# Altium schematic sheet MOSFETS.SchDoc
size A4; SheetNumber: 3; SheetTotal: 7
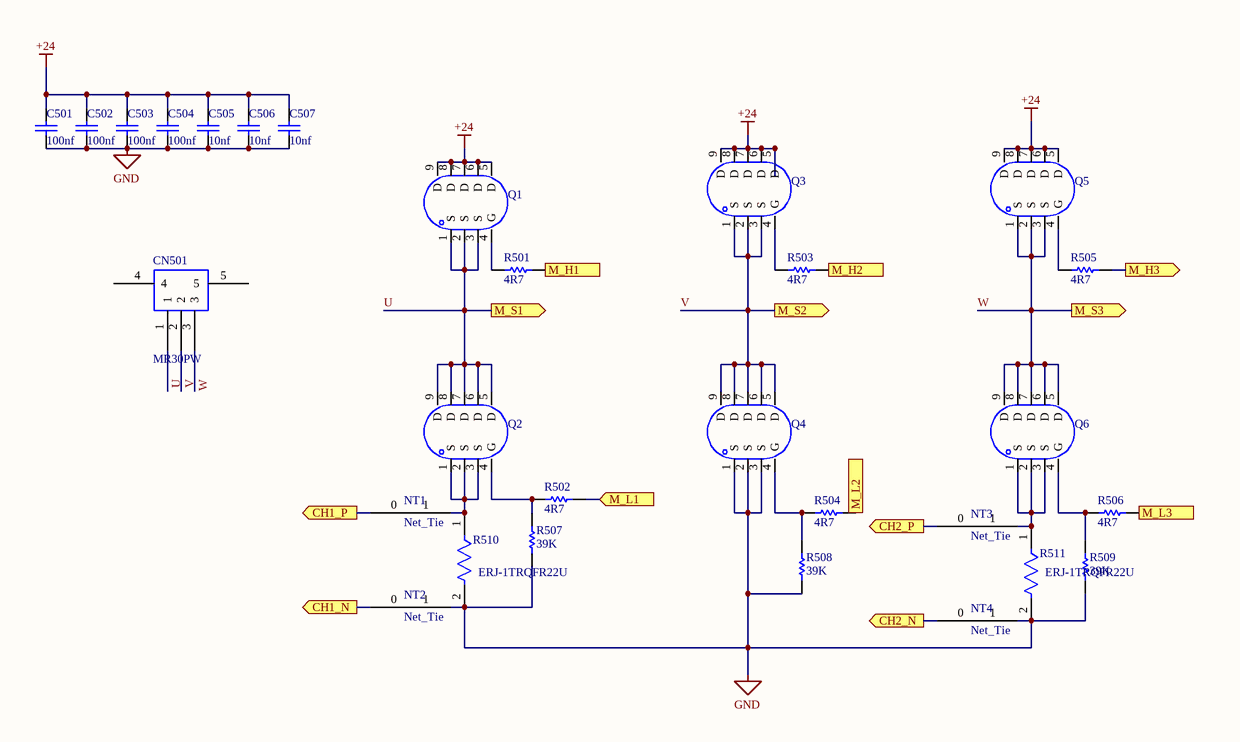
[diagram p0: MOSFETS.SchDoc]

## Parts
C501  100nf  [AVX-1206-2_L]
C502  100nf  [AVX-1206-2_L]
C503  100nf  [AVX-1206-2_L]
C504  100nf  [AVX-1206-2_L]
C505  10nf  [AVX-1206-2_L]
C506  10nf  [AVX-1206-2_L]
C507  10nf  [AVX-1206-2_L]
CN501  MR30PW  [MR30]
NT1  Net_Tie  [NT]  (net tie, no BOM)
NT2  Net_Tie  [NT]  (net tie, no BOM)
NT3  Net_Tie  [NT]  (net tie, no BOM)
NT4  Net_Tie  [NT]  (net tie, no BOM)
Q1  TPH1R403NL  [DSOP-8_L5.0-W5.0-P1.27-EP-TL]  (value not drawn)
Q2  TPH1R403NL  [DSOP-8_L5.0-W5.0-P1.27-EP-TL]  (value not drawn)
Q3  TPH1R403NL  [DSOP-8_L5.0-W5.0-P1.27-EP-TL]  (value not drawn)
Q4  TPH1R403NL  [DSOP-8_L5.0-W5.0-P1.27-EP-TL]  (value not drawn)
Q5  TPH1R403NL  [DSOP-8_L5.0-W5.0-P1.27-EP-TL]  (value not drawn)
Q6  TPH1R403NL  [DSOP-8_L5.0-W5.0-P1.27-EP-TL]  (value not drawn)
R501  4R7  [RESC1608X55X25ML10T15]
R502  4R7  [RESC1608X55X25ML10T15]
R503  4R7  [RESC1608X55X25ML10T15]
R504  4R7  [RESC1608X55X25ML10T15]
R505  4R7  [RESC1608X55X25ML10T15]
R506  4R7  [RESC1608X55X25ML10T15]
R507  39K  [RESC1608X55X25ML10T15]
R508  39K  [RESC1608X55X25ML10T15]
R509  39K  [RESC1608X55X25ML10T15]
R510  ERJ-1TRQFR22U  [FP-ERJ1TR-MFG]
R511  ERJ-1TRQFR22U  [FP-ERJ1TR-MFG]

## Ports
CH1_N (out), CH1_P (out), CH2_N (out), CH2_P (out), M_H1 (out), M_H2 (out), M_H3 (out), M_L1 (in), M_L2 (in), M_L3 (in), M_S1 (out), M_S2 (out), M_S3 (out)

## Nets
+24: C501.2 C502.2 C503.2 C504.2 C505.2 C506.2 C507.2 Q1.5(D) Q1.6(D) Q1.7(D) Q1.8(D) Q1.9(D) Q3.5(D) Q3.6(D) Q3.7(D) Q3.8(D) Q3.9(D) Q5.5(D) Q5.6(D) Q5.7(D) Q5.8(D) Q5.9(D)
GND: C501.1 C502.1 C503.1 C504.1 C505.1 C506.1 C507.1 NT2.1 NT4.1 Q4.1(S) Q4.2(S) Q4.3(S) R507.1 R508.1 R509.1 R510.2 R511.2
CH1_N: NT2.0 ; port CH1_N
CH1_P: NT1.0 ; port CH1_P
CH2_N: NT4.0 ; port CH2_N
CH2_P: NT3.0 ; port CH2_P
M_H1: R501.1 ; port M_H1
M_H2: R503.1 ; port M_H2
M_H3: R505.1 ; port M_H3
M_L1: R502.1 ; port M_L1
M_L2: R504.1 ; port M_L2
M_L3: R506.1 ; port M_L3
U: CN501.1 Q1.1(S) Q1.2(S) Q1.3(S) Q2.5(D) Q2.6(D) Q2.7(D) Q2.8(D) Q2.9(D) ; port M_S1
V: CN501.2 Q3.1(S) Q3.2(S) Q3.3(S) Q4.5(D) Q4.6(D) Q4.7(D) Q4.8(D) Q4.9(D) ; port M_S2
W: CN501.3 Q5.1(S) Q5.2(S) Q5.3(S) Q6.5(D) Q6.6(D) Q6.7(D) Q6.8(D) Q6.9(D) ; port M_S3
NetNT1_1: NT1.1 Q2.1(S) Q2.2(S) Q2.3(S) R510.1
NetNT3_1: NT3.1 Q6.1(S) Q6.2(S) Q6.3(S) R511.1
NetQ1_4: Q1.4(G) R501.2
NetQ2_4: Q2.4(G) R502.2 R507.2
NetQ3_4: Q3.4(G) R503.2
NetQ4_4: Q4.4(G) R504.2 R508.2
NetQ5_4: Q5.4(G) R505.2
NetQ6_4: Q6.4(G) R506.2 R509.2

Not connected (* = marked no-connect by the designer): CN501 4 5

## Library data of the parts
C501-C507 = CMP-2000-05468-1: Chip Capacitor, 1 nF, +/- 10%, -55 to 125 degC, 1206 (3216 Metric), RoHS, Tape and Reel; PartNumber: 1206GC102KAT1A; Manufacturer: AVX; Capacitance: 0.001uF; Dielectric: X7R; Voltage Rating DC: 2000V; Package Reference: 1206; Datasheet Version: 11/2010; Mounting Technology: SurfaceMount; Manufacturer URL: http://www.avx.com/; Tolerance: 10%; Tolerance (%): ±10%; Datasheet URL: https://datasheet.ciiva.com/11787/0900766b80ed4c37-11787781.pdf; Package Description: 2-Pin SMD, Body 3.4 x 1.8 mm; Case Size/Dimension: 1206; Rated Voltage: 2000V
CN501 = Component_1
Q1-Q6 = TPH1R403NL: Manufacturer: TOSHIBA(东芝); Add into BOM: yes; Type: N沟道; Drain Source Voltage (Vdss): 30V; Continuous Drain Current (Id): 150A; Power Dissipation (Pd): 64W; Drain Source On Resistance (RDS(on)@Vgs,Id): 1.4mΩ@10V,30A; Gate Threshold Voltage (Vgs(th)@Id): 2.3V@500A; Symbol: TPH1R403NL; Device: TPH1R403NL; LCSC Part Name: N沟道 30V 150A; Supplier Part: C83440; Manufacturer Part: TPH1R403NL; Supplier Footprint: SOP Advance; JLCPCB Part Class: Extended Part; Datasheet: https://atta.szlcsc.com/upload/public/pdf/source/20170908/C83440_1504870121708958077.pdf; Supplier: LCSC; Convert to PCB: yes
R501-R509 = CMP-2100-03667-1: Chip Resistor, 0 Ohm, +/- 5%, 0.1 W, -55 to 155 degC, 0603 (1608 Metric), RoHS, Tape and Reel; Manufacturer: Yageo; Temperature Coefficient: 200ppm/degreesC; Voltage Rating: 50V; Power Rating: 100mW; Resistance: 0mOhm; Width: 0.8mm; Max Operating Temperature: 155degC; Tolerance: 5%; Package Reference: 0603; Height: 0.45mm; Depth: 0.8mm; Package Description: 2-Pin Surface Mount Device, Body 1.6 x 0.8 mm; Termination: SMD/SMT; Package Quantity: 5000; Case/Package: 0603; Case Code (Imperial): 0603; Radiation Hardening: No; Number of Pins: 2; Length: 1.6mm; Lead Free: LeadFree; Voltage Rating (DC): 50V; Military Standard: Not; Datasheet URL: http://www.yageo.com/NewPortal/yageodocoutput?fileName=/pdf/R-Chip/PYu-RC_Group_51_RoHS_L_5.pdf; Manufacturer URL: http://www.yageo.com/; Packaging: TapeandReel; Case Code (Metric): 1608; Min Operating Temperature: -55degC; Composition: ThickFilm; RoHSCompliant: true; Contact Plating: Tin; Datasheet Version: Rev. 5, 10/2016; REACH SVHC: NoSVHC
R510 R511 = CMP-05422-000060-1: RES 0.22 OHM 1% 1W 2512; Manufacturer: Panasonic; 3DS Part Number: 110-00006; Value: 0.22Ω; Automotive Grade: Grade 0; Temperature Coefficient: 200ppm/°C; Digikey Description: RES 0.22 OHM 1% 1W 2512; Tolerance: 1%; Temperature Range High: +155°C; Temperature Range Low: -55°C; Series: ERJ; Category: Res; Power Rating: 1W; ComponentLink2URL: https://industrial.panasonic.com/cdbs/www-data/pdf/RDN0000/AOA0000C313.pdf; Device Class L1: Passive Components; Octopart: https://octopart.com/erj1trqfr22u-panasonic-10566390; Device Class L3: Chip SMD Resistors; Temperature: -55°C to +155°C; Composition: Thick Film; Device Class L2: Resistors; Footprint Url: https://industrial.panasonic.com/cdbs/www-data/pdf/RDN0000/DMN0000COL17.pdf; Ipc Land Pattern Name: RESC640320X60; Package: ERJ1TR; Resistance: 0.22Ω; Mouser Description: Current Sense Resistors 2512 0.22ohm 1% Curr Sense AEC-Q200; Manufacturer Part Number: ERJ-1TRQFR22U; RoHS: TRUE; ComponentLink2Description: Datasheet; Lead Free: Yes; Height: 0.7mm; Automotive: Yes